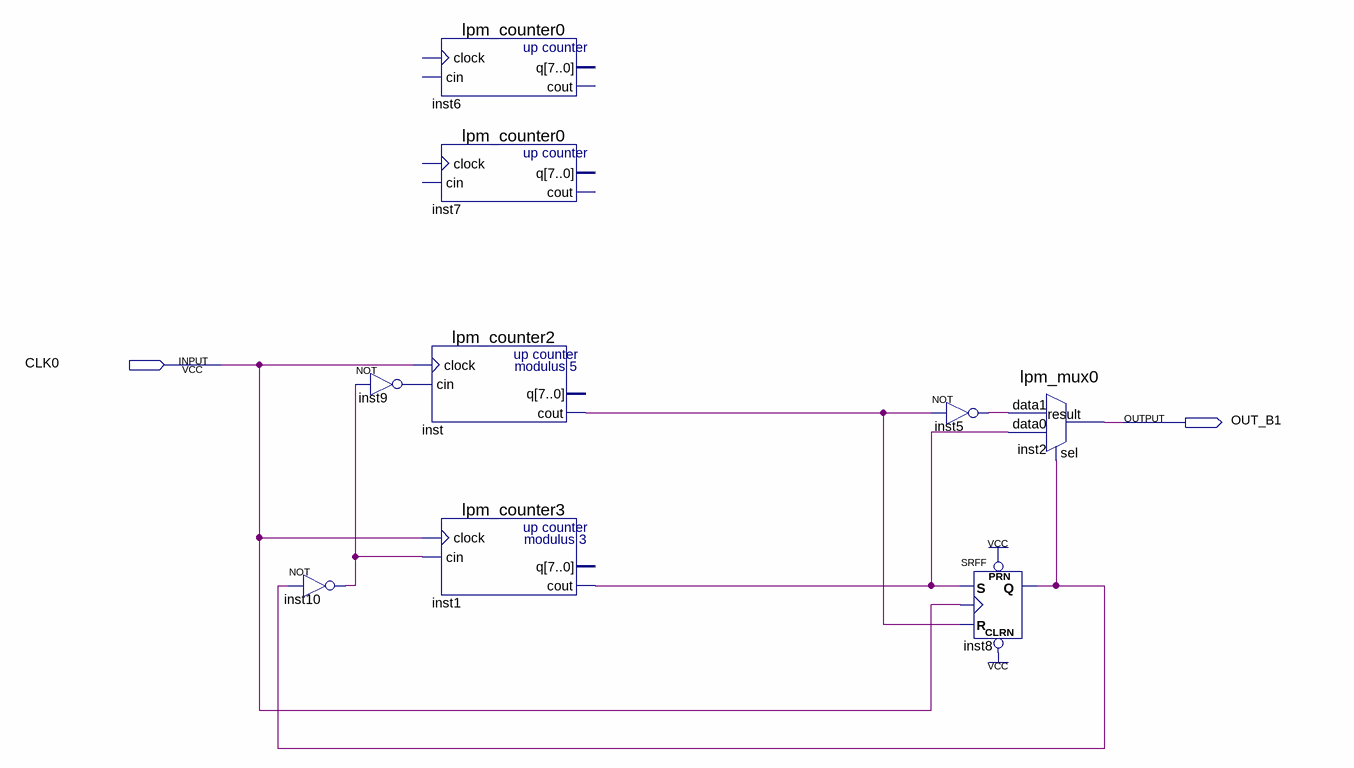
[diagram p0: schematic sheet]
// Quartus schematic Lab2.bdf as structural Verilog: 9 symbols, 2 pins
module Lab2 (
  input  CLK0,
  output OUT_B1
);

  wire inst1_cout, inst5_out, inst8_q, inst9_out, inst10_out, inst_cout;

  not inst9 (inst9_out, inst10_out);
  not inst10 (inst10_out, inst8_q);
  lpm_counter0 inst6 ();  // open: clock, cin, q, cout
  lpm_counter0 inst7 ();  // open: clock, cin, q, cout
  lpm_counter2 inst (.clock(CLK0), .cin(inst9_out), .cout(inst_cout));  // open: q
  lpm_counter3 inst1 (.clock(CLK0), .cin(inst10_out), .cout(inst1_cout));  // open: q
  not inst5 (inst5_out, inst_cout);
  SRFF inst8 (.PRN(1'b1), .CLRN(1'b1), .S(inst1_cout), .R(inst_cout), .CLK(CLK0), .Q(inst8_q));
  lpm_mux0 inst2 (.data1(inst5_out), .data0(inst1_cout), .sel(inst8_q), .result(OUT_B1));
endmodule
